# EAGLE design main (EAGLE 9.4.2)

## Sheet 1 of 3: MSP430FR5989 Main Components
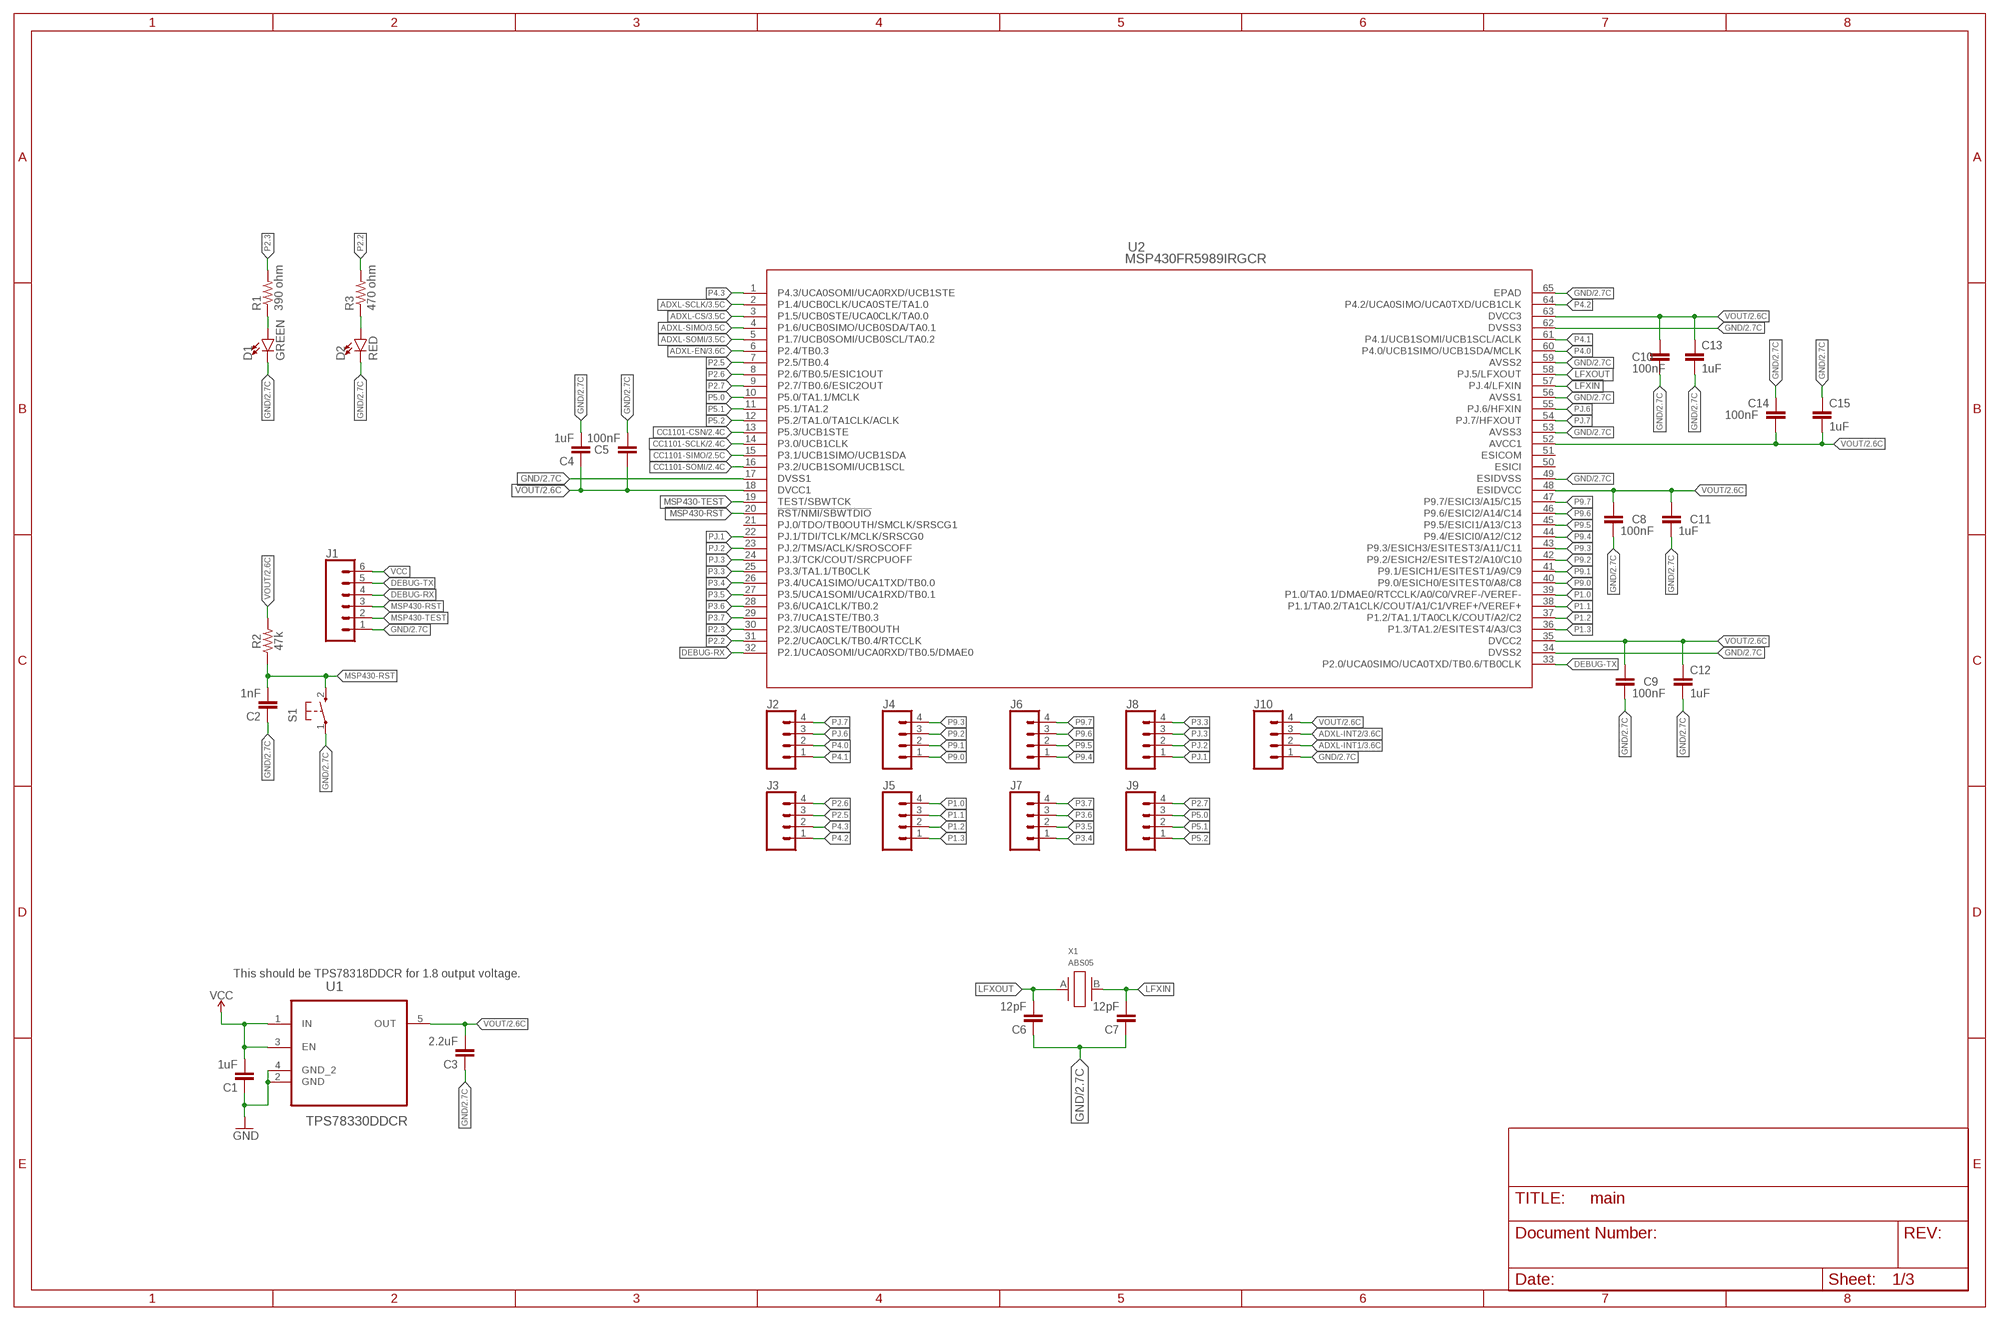
[diagram p0: schematic, sheet 1]

### Parts
C1  1uF  C-EU0603  [0603]
C2  1nF  C-EU0603  [0603]
C3  2.2uF  C-EU0603  [0603]
C4  1uF  C-EU0603  [0603]
C5  100nF  C-EU0603  [0603]
C6  12pF  C-EU0603  [0603]
C7  12pF  C-EU0603  [0603]
C8  100nF  C-EU0603  [0603]
C9  100nF  C-EU0603  [0603]
C10  100nF  C-EU0603  [0603]
C11  1uF  C-EU0603  [0603]
C12  1uF  C-EU0603  [0603]
C13  1uF  C-EU0603  [0603]
C14  100nF  C-EU0603  [0603]
C15  1uF  C-EU0603  [0603]
D1  GREEN  LED-GREEN0603  [LED-0603]
D2  RED  LED-RED0603  [LED-0603]
J1  CONN_06SILK_FEMALE_PTH  [1X06]
J2  CONN_041.27MM  [1X04_1.27MM]
J3  CONN_041.27MM  [1X04_1.27MM]
J4  CONN_041.27MM  [1X04_1.27MM]
J5  CONN_041.27MM  [1X04_1.27MM]
J6  CONN_041.27MM  [1X04_1.27MM]
J7  CONN_041.27MM  [1X04_1.27MM]
J8  CONN_041.27MM  [1X04_1.27MM]
J9  CONN_041.27MM  [1X04_1.27MM]
J10  CONN_041.27MM  [1X04_1.27MM]
R1  390 ohm  R-EU  [0402]
R2  47k  47KOHM-0603-1/10W-1%  [0603]
R3  470 ohm  R-EU  [0402]
S1  ELECTRICALMETER_PB  [ELECTRICALMETER_PBTH]
U1  TPS78330DDCR  [SOT95P280X110-5N]
U2  MSP430FR5989IRGCR  [RGC64_4P25X4P25]
X1  ABS05  ABS05-32.768KHZ-9-T  [ABS05]

### Nets
ADXL-CS: U2.3(P1.5/UCB0STE/UCA0CLK/TA0.0) ; also sheet 3
ADXL-EN: U2.6(P2.4/TB0.3) ; also sheet 3
ADXL-INT1: J10.2 ; also sheet 3
ADXL-INT2: J10.3 ; also sheet 3
ADXL-SCLK: U2.2(P1.4/UCB0CLK/UCA0STE/TA1.0) ; also sheet 3
ADXL-SIMO: U2.4(P1.6/UCB0SIMO/UCB0SDA/TA0.1) ; also sheet 3
ADXL-SOMI: U2.5(P1.7/UCB0SOMI/UCB0SCL/TA0.2) ; also sheet 3
CC1101-CSN: U2.13(P5.3/UCB1STE) ; also sheet 2
CC1101-SCLK: U2.14(P3.0/UCB1CLK) ; also sheet 2
CC1101-SIMO: U2.15(P3.1/UCB1SIMO/UCB1SDA) ; also sheet 2
CC1101-SOMI: U2.16(P3.2/UCB1SOMI/UCB1SCL) ; also sheet 2
DEBUG-RX: J1.4 U2.32(P2.1/UCA0SOMI/UCA0RXD/TB0.5/DMAE0)
DEBUG-TX: J1.5 U2.33(P2.0/UCA0SIMO/UCA0TXD/TB0.6/TB0CLK)
GND: C1.1 C2.1 C3.1 C4.2 C5.2 C6.1 C7.1 C8.2 C9.2 C10.2 C11.2 C12.2 C13.2 C14.1 C15.1 D1.C D2.C J1.1 J10.1 S1.1(P) U1.2(GND) U1.4(GND_2) U2.17(DVSS1) U2.34(DVSS2) U2.49(ESIDVSS) U2.53(AVSS3) U2.56(AVSS1) U2.59(AVSS2) U2.62(DVSS3) U2.65(EPAD) ; also sheet 2,3
LFXIN: C7.2 U2.57(PJ.4/LFXIN) X1.B
LFXOUT: C6.2 U2.58(PJ.5/LFXOUT) X1.A
MSP430-RST: C2.2 J1.3 R2.1 S1.2(S) U2.20(!RST/NMI/SBWTDIO)
MSP430-TEST: J1.2 U2.19(TEST/SBWTCK)
N$19: D1.A R1.1
N$20: D2.A R3.1
P1.0: J5.4 U2.39(P1.0/TA0.1/DMAE0/RTCCLK/A0/C0/VREF-/VEREF-)
P1.1: J5.3 U2.38(P1.1/TA0.2/TA1CLK/COUT/A1/C1/VREF+/VEREF+)
P1.2: J5.2 U2.37(P1.2/TA1.1/TA0CLK/COUT/A2/C2)
P1.3: J5.1 U2.36(P1.3/TA1.2/ESITEST4/A3/C3)
P2.2: R3.2 U2.31(P2.2/UCA0CLK/TB0.4/RTCCLK)
P2.3: R1.2 U2.30(P2.3/UCA0STE/TB0OUTH)
P2.5: J3.3 U2.7(P2.5/TB0.4)
P2.6: J3.4 U2.8(P2.6/TB0.5/ESIC1OUT)
P2.7: J9.4 U2.9(P2.7/TB0.6/ESIC2OUT)
P3.3: J8.4 U2.25(P3.3/TA1.1/TB0CLK)
P3.4: J7.1 U2.26(P3.4/UCA1SIMO/UCA1TXD/TB0.0)
P3.5: J7.2 U2.27(P3.5/UCA1SOMI/UCA1RXD/TB0.1)
P3.6: J7.3 U2.28(P3.6/UCA1CLK/TB0.2)
P3.7: J7.4 U2.29(P3.7/UCA1STE/TB0.3)
P4.0: J2.2 U2.60(P4.0/UCB1SIMO/UCB1SDA/MCLK)
P4.1: J2.1 U2.61(P4.1/UCB1SOMI/UCB1SCL/ACLK)
P4.2: J3.1 U2.64(P4.2/UCA0SIMO/UCA0TXD/UCB1CLK)
P4.3: J3.2 U2.1(P4.3/UCA0SOMI/UCA0RXD/UCB1STE)
P5.0: J9.3 U2.10(P5.0/TA1.1/MCLK)
P5.1: J9.2 U2.11(P5.1/TA1.2)
P5.2: J9.1 U2.12(P5.2/TA1.0/TA1CLK/ACLK)
P9.0: J4.1 U2.40(P9.0/ESICH0/ESITEST0/A8/C8)
P9.1: J4.2 U2.41(P9.1/ESICH1/ESITEST1/A9/C9)
P9.2: J4.3 U2.42(P9.2/ESICH2/ESITEST2/A10/C10)
P9.3: J4.4 U2.43(P9.3/ESICH3/ESITEST3/A11/C11)
P9.4: J6.1 U2.44(P9.4/ESICI0/A12/C12)
P9.5: J6.2 U2.45(P9.5/ESICI1/A13/C13)
P9.6: J6.3 U2.46(P9.6/ESICI2/A14/C14)
P9.7: J6.4 U2.47(P9.7/ESICI3/A15/C15)
PJ.1: J8.1 U2.22(PJ.1/TDI/TCLK/MCLK/SRSCG0)
PJ.2: J8.2 U2.23(PJ.2/TMS/ACLK/SROSCOFF)
PJ.3: J8.3 U2.24(PJ.3/TCK/COUT/SRCPUOFF)
PJ.6: J2.3 U2.55(PJ.6/HFXIN)
PJ.7: J2.4 U2.54(PJ.7/HFXOUT)
VCC: C1.2 J1.6 U1.1(IN) U1.3(EN)
VOUT: C3.2 C4.1 C5.1 C8.1 C9.1 C10.1 C11.1 C12.1 C13.1 C14.2 C15.2 J10.4 R2.2 U1.5(OUT) U2.18(DVCC1) U2.35(DVCC2) U2.48(ESIDVCC) U2.52(AVCC1) U2.63(DVCC3) ; also sheet 2,3
Unconnected: U2.21(PJ.0/TDO/TB0OUTH/SMCLK/SRSCG1) U2.50(ESICI) U2.51(ESICOM)

### Notes on the sheet
- This should be TPS78318DDCR for 1.8 output voltage.

## Sheet 2 of 3: CC1101 components
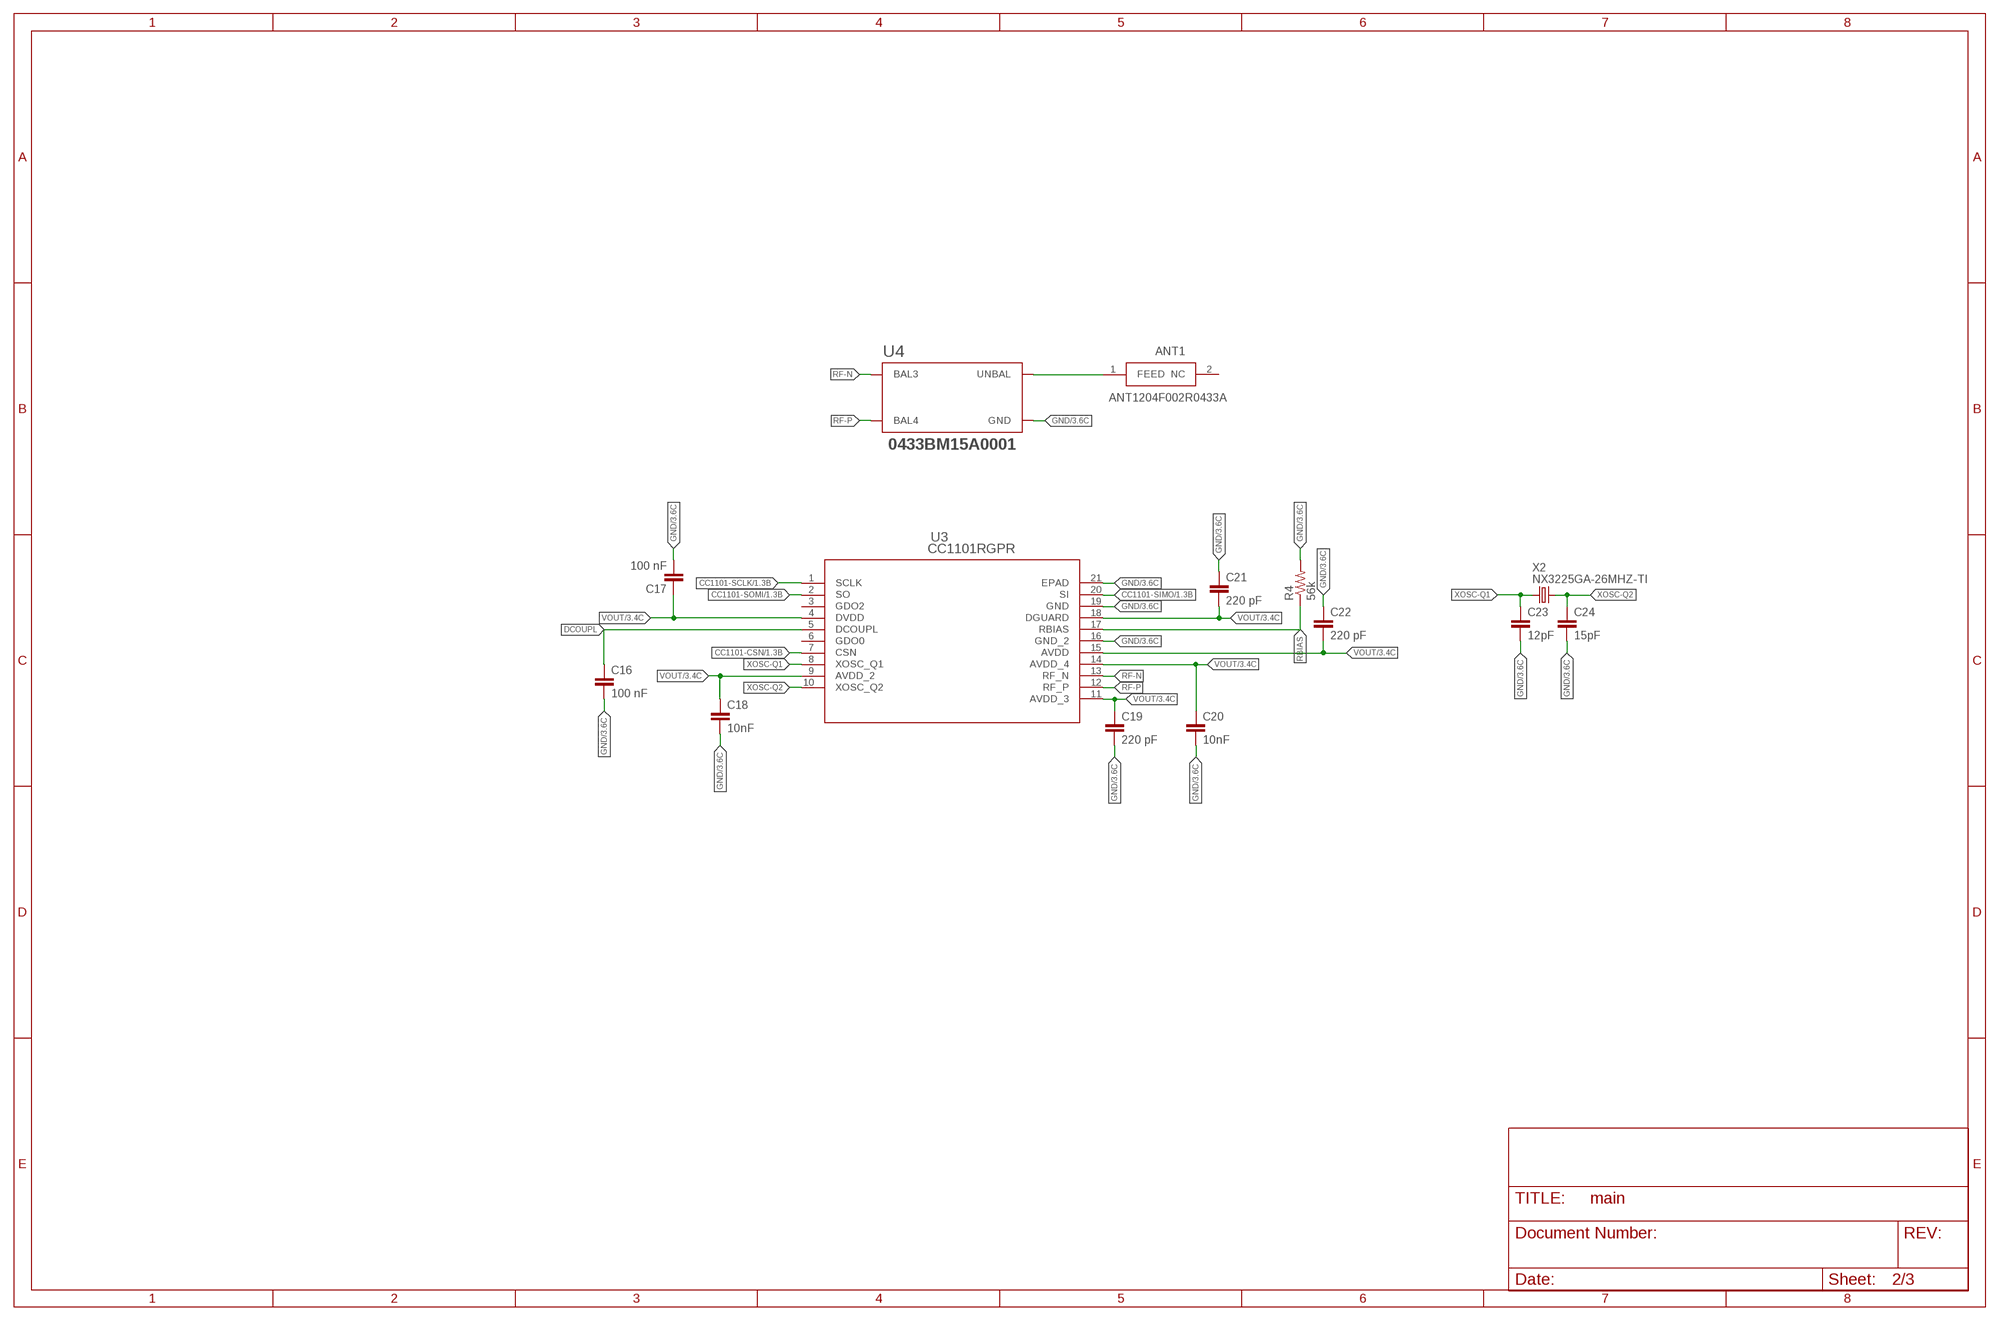
[diagram p1: schematic, sheet 2]

### Parts
ANT1  ANT1204F002R0433A  [ANTC12340X180N]
C16  100 nF  C-EU0603  [0603]
C17  100 nF  C-EU0603  [0603]
C18  10nF  C-EU0603  [0603]
C19  220 pF  C-EU0603  [0603]
C20  10nF  C-EU0603  [0603]
C21  220 pF  C-EU0603  [0603]
C22  220 pF  C-EU0603  [0603]
C23  12pF  C-EU0603  [0603]
C24  15pF  C-EU0603  [0603]
R4  56k  R-EU0603  [0603]
U3  CC1101RGPR  [RGP20_2P4X2P4]
U4  0433BM15A0001  [XXXXBM15A0001]
X2  NX3225GA-26MHZ-TI  XTAL-3.2X2.5  [XTAL-3.2X2.5]

### Nets
CC1101-CSN: U3.7(CSN) ; also sheet 1
CC1101-SCLK: U3.1(SCLK) ; also sheet 1
CC1101-SIMO: U3.20(SI) ; also sheet 1
CC1101-SOMI: U3.2(SO) ; also sheet 1
DCOUPL: C16.1 U3.5(DCOUPL)
GND: C16.2 C17.2 C18.2 C19.2 C20.2 C21.1 C22.1 C23.2 C24.2 R4.2 U3.16(GND_2) U3.19(GND) U3.21(EPAD) U4.2(GND) U4.5(GND) U4.6(GND) ; also sheet 1,3
N$3: ANT1.1(FEED) U4.1(UNBAL)
RBIAS: R4.1 U3.17(RBIAS)
RF-N: U3.13(RF_N) U4.3(BAL3)
RF-P: U3.12(RF_P) U4.4(BAL4)
VOUT: C17.1 C18.1 C19.1 C20.1 C21.2 C22.2 U3.4(DVDD) U3.9(AVDD_2) U3.11(AVDD_3) U3.14(AVDD_4) U3.15(AVDD) U3.18(DGUARD) ; also sheet 1,3
XOSC-Q1: C23.1 U3.8(XOSC_Q1) X2.1
XOSC-Q2: C24.1 U3.10(XOSC_Q2) X2.3
Unconnected: ANT1.2(NC) U3.3(GDO2) U3.6(GDO0)

## Sheet 3 of 3: ADXL362 Acceloremeter
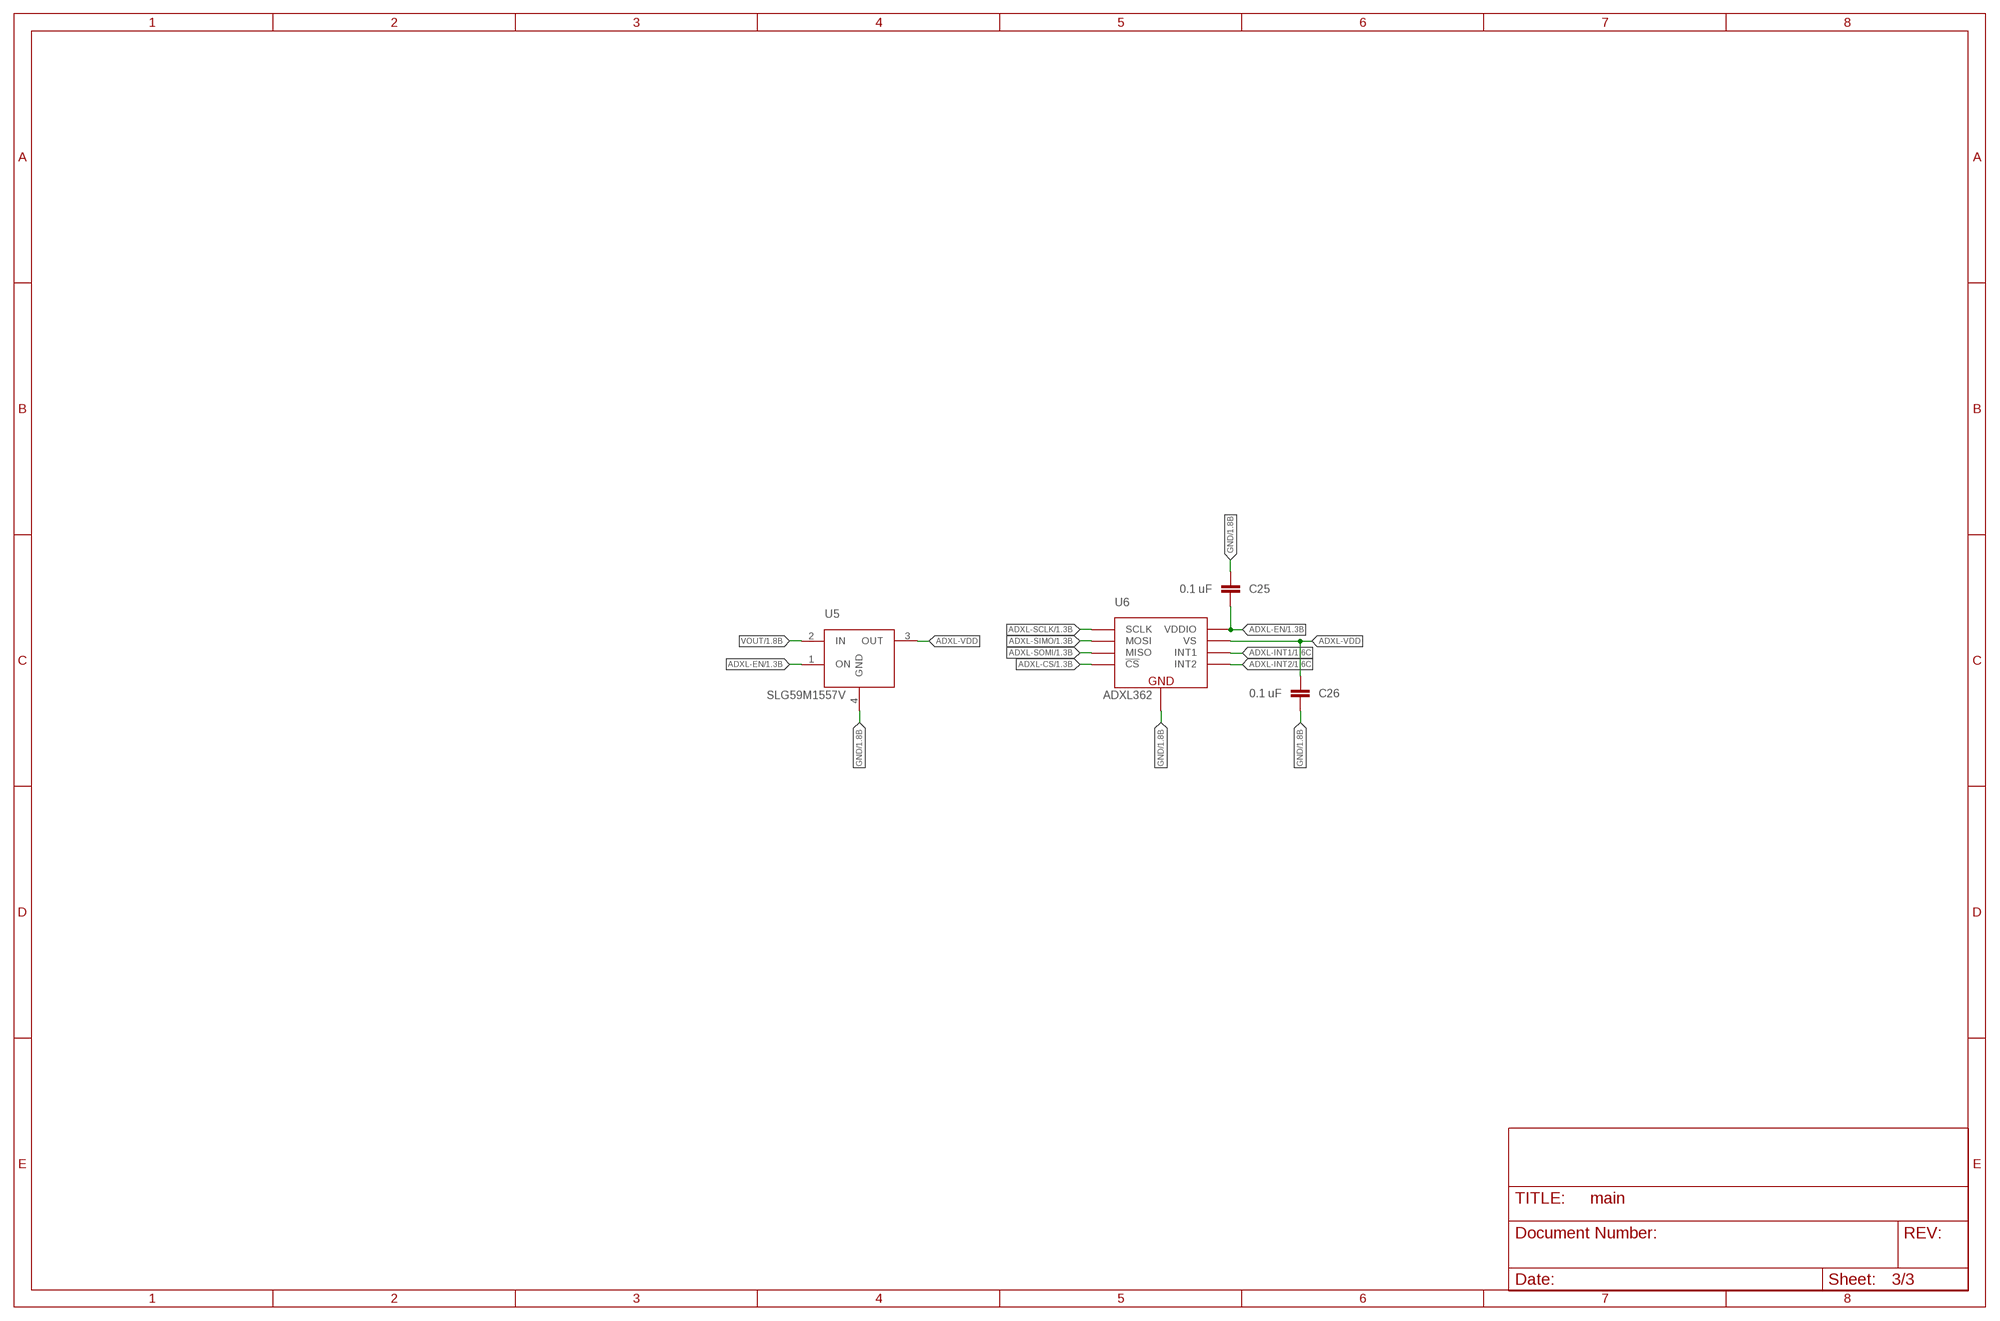
[diagram p2: schematic, sheet 3]

### Parts
C25  0.1 uF  C-EU0603  [0603]
C26  0.1 uF  C-EU0603  [0603]
U5  SLG59M1557V  [4STDFN]
U6  ADXL362  [ADXL362]

### Nets
ADXL-CS: U6.P$8(!CS) ; also sheet 1
ADXL-EN: C25.1 U5.1(ON) U6.P$1(VDDIO) ; also sheet 1
ADXL-INT1: U6.P$11(INT1) ; also sheet 1
ADXL-INT2: U6.P$9(INT2) ; also sheet 1
ADXL-SCLK: U6.P$4(SCLK) ; also sheet 1
ADXL-SIMO: U6.P$6(MOSI) ; also sheet 1
ADXL-SOMI: U6.P$7(MISO) ; also sheet 1
ADXL-VDD: C26.2 U5.3(OUT) U6.P$14(VS)
GND: C25.2 C26.1 U5.4(GND) U6.P$12(GND) U6.P$13(GND) U6.P$16(GND) ; also sheet 1,2
VOUT: U5.2(IN) ; also sheet 1,2

## Library data of the parts
ANT1 = ANT1204F002R0433A:ANT1204F002R0433A: YAGEO - ANT1204F002R0433A - ANTENNA CHIP, 433MHZ, 50 OHM, 1204 Source: Datasheet <http://www.yageo.com/documents/recent/An_SMD_UHF_433_1204_0.pdf>; DESCRIPTION: YAGEO - ANT1204F002R0433A - ANTENNA CHIP, 433MHZ, 50 OHM, 1204; HEIGHT: 1.8mm; MANUFACTURER_NAME: YAGEO (PHYCOMP); MANUFACTURER_PART_NUMBER: ANT1204F002R0433A; MOUSER_PART_NUMBER: 603-ANT1204F002R0433; MOUSER_PRICE-STOCK: https://www.mouser.com/Search/Refine.aspx?Keyword=603-ANT1204F002R0433
C1-C5 C8-C15 C25 C26 = tiny_passives:C-EU
C6 C7 = tiny_passives:C-EU; MPN: CL10C120JB8NNNC
C16-C22 = tiny_passives:C-EU; MPN: GCJ188R71H104KA12D
C23 = tiny_passives:C-EU; MPN: 06035A120FAT2A
C24 = tiny_passives:C-EU; MPN: C1608C0G1H150J080AA
D1 = SparkFun-LED:LED-GREEN: Green SMD LED Used in manufacturing of various products at SparkFun Packages: 0603 - SMD 0603 package [Product Link] <http://www.futureelectronics.com/en/technologies/semiconductors/optoelectronics/leds/Pages/9894312-LTST-C190GKT.aspx?CrossPart=HSMG-C190&IM=0> LilyPad 1206 - SMD1206 LilyPad package [Product Link] <http://www.futureelectronics.com/en/Technologies/Product.aspx?ProductID=IN150NGHARVATEKCORPORATION2049943&IM=0> 1206 - SMD1206 package [Product Link] <http://www.futureelectronics.com/en/technologies/semiconductors/optoelectronics/leds/Pages/8315665-LTST-C150KGKT.aspx?IM=0> 1206 Bottom Mount -SMD 1206 Bottom Mount [Product Link] <http://www.digikey.com/product-detail/en/lite-on-inc/LTST-C230KGKT/160-1456-1-ND/386854> SparkFun Products: Pro Mini 328 -5V <https://www.sparkfun.com/products/821> RedBoard <https://www.sparkfun.com/products/12757> MP3 Trigger <https://www.sparkfun.com/products/13720> Makey Makey <https://www.sparkfun.com/products/11076>; PROD_ID: DIO-00821
D2 = SparkFun-LED:LED-RED: Red SMD LED Used in manufacturing of most products at SparkFun Packages: 0603 - SMD 0603 package [Product Link] <http://docs.avagotech.com/docs/AV02-0551EN> 0603 SMART - SMD 0603 SMART package ( more efficient and expensive)[Product Link] <http://www.osram-os.com/Graphics/XPic2/00077099_0.pdf> 1206 - SMD1206 package [Product Link] <https://www.sparkfun.com/datasheets/DevTools/LilyPad/Q150OVS4.pdff> SparkFun Products: Pro Mini 328 -5V <https://www.sparkfun.com/products/821> RedBoard <https://www.sparkfun.com/products/12757> IOIO-OTG <https://www.sparkfun.com/products/13613>; PROD_ID: DIO-00819
J1 = SparkFun-Connectors:CONN_06: Multi connection point. Often used as Generic Header-pin footprint for 0.1 inch spaced/style header connections On any of the 0.1 inch spaced packages, you can populate with these: Break Away Headers - Straight <https://www.sparkfun.com/products/116> (PRT-00116) Break Away Male Headers - Right Angle <https://www.sparkfun.com/products/553> (PRT-00553) Female Headers <https://www.sparkfun.com/products/115> (PRT-00115) Break Away Headers - Machine Pin <https://www.sparkfun.com/products/117> (PRT-00117) Break Away Female Headers - Swiss Machine Pin <https://www.sparkfun.com/products/743> (PRT-00743) Arduino Stackable Header - 6 Pin <https://www.sparkfun.com/products/9280> (PRT-09280) For SCREWTERMINALS and SPRING TERMINALS visit here: Screw Terimnals on SparkFun.com <https://www.sparkfun.com/search/results?term=Screw+Terminals> (5mm/3.5mm/2.54mm spacing) This device is also useful as a general connection point to wire up your design to another part of your project. Our various solder wires solder well into these plated through hole pads. Hook-Up Wire - Assortment (Stranded, 22 AWG) <https://www.sparkfun.com/products/11375> (PRT-11375) Hook-Up Wire - Assortment (Solid Core, 22 AWG) <https://www.sparkfun.com/products/11367> (PRT-11367) View the entire wire category on our website here <https://www.sparkfun.com/categories/141>; PROD_ID: CONN-08437
J2-J10 = SparkFun-Connectors:CONN_04: Multi connection point. Often used as Generic Header-pin footprint for 0.1 inch spaced/style header connections On any of the 0.1 inch spaced packages, you can populate with these: Break Away Headers - Straight <https://www.sparkfun.com/products/116> (PRT-00116) Break Away Male Headers - Right Angle <https://www.sparkfun.com/products/553> (PRT-00553) Female Headers <https://www.sparkfun.com/products/115> (PRT-00115) Break Away Headers - Machine Pin <https://www.sparkfun.com/products/117> (PRT-00117) Break Away Female Headers - Swiss Machine Pin <https://www.sparkfun.com/products/743> (PRT-00743) For SCREWTERMINALS and SPRING TERMINALS visit here: Screw Terimnals on SparkFun.com <https://www.sparkfun.com/search/results?term=Screw+Terminals> (5mm/3.5mm/2.54mm spacing) This device is also useful as a general connection point to wire up your design to another part of your project. Our various solder wires solder well into these plated through hole pads. Hook-Up Wire - Assortment (Stranded, 22 AWG) <https://www.sparkfun.com/products/11375> (PRT-11375) Hook-Up Wire - Assortment (Solid Core, 22 AWG) <https://www.sparkfun.com/products/11367> (PRT-11367) View the entire wire category on our website here <https://www.sparkfun.com/categories/141> Special notes: Molex polarized connector foot print use with SKU : PRT-08231 with associated crimp pins and housings. 1MM SMD Version SKU: PRT-10208; SPICEPREFIX: E
R1 R3 = tiny_passives:R-EU
R2 = SparkFun-Resistors:47KOHM: 47kΩ resistor A resistor is a passive two-terminal electrical component that implements electrical resistance as a circuit element. Resistors act to reduce current flow, and, at the same time, act to lower voltage levels within circuits. - Wikipedia; PROD_ID: RES-07871
R4 = tiny_passives:R-EU; MPN: ERJ-3GEYJ563V
S1 = tactile-switch:ELECTRICALMETER_PB: OMRON SWITCH
U1 = Texas Instruments_By_element14_Batch_1:TPS78330DDCR: 500nA IQ, 150mA, Ultra-Low Quiescent Current Low-Dropout Linear Regulator; MPN: TPS78330DDCR; OC_FARNELL: -; OC_NEWARK: 72R6681; PACKAGE: SOT-5; SUPPLIER: Texas Instruments
U2 = msp430fr5989irgcr:MSP430FR5989IRGCR; MANUFACTURER_PART_NUMBER: MSP430FR5989IRGCR; VENDOR: Texas Instruments
U3 = cc1101RGPR:CC1101RGPR; MANUFACTURER_PART_NUMBER: CC1101RGPR; VENDOR: Vendor
U4 = johanson-baluns:0433BM15A0001: 430/403 MHz Impedance Matched Balun/LPF Integrated Component for T.I. Chipsets: CC1100, CC1101, CC110L, CC1111, CC1130, CC1131, CC1150, CC1151, CC113L, CC115L, CC430 and RF430.
U5 = loadswitches:SLG59M1557V: SILEGO SLG59M1557V: Ultra-small 28.5 mΩ, 1.0 A Integrated Power Switch with Discharge The SLG59M1557V is designed for load switching applications with ultra low quiescent current (20nA), and low turn on voltage (0.85V). The part comes with one 28.5 mΩ 1.0 A rated P-channel MOSFET controlled by a single ON control pin. The product is packaged in an ultra-small 1.0 x 1.0 mm package.; MANAFACTURER: SLG59M1557V; MOUSER: 402-SLG59M1557V; MPN: SLG59M1557V
U6 = adxl362:ADXL362: Micropower 3-axis accelerometer 2/4/8g digital output (SPI); DIGIKEY: ADXL362BCCZ-RL7CT-ND; MPN: ADXL362BCCZ-RL7
X1 = abs05:ABS05-32.768KHZ: 32.768kHz Crystal; DIGIKEY: 535-11897-1-ND; MPN: ABS05-32.768KHZ-9-T
X2 = cc1101:XTAL

## Net classes
1 Ground: width 0.203 mm, drill 0.305 mm, clearance 0.152 mm to class 0, clearance 0.152 mm

## Board
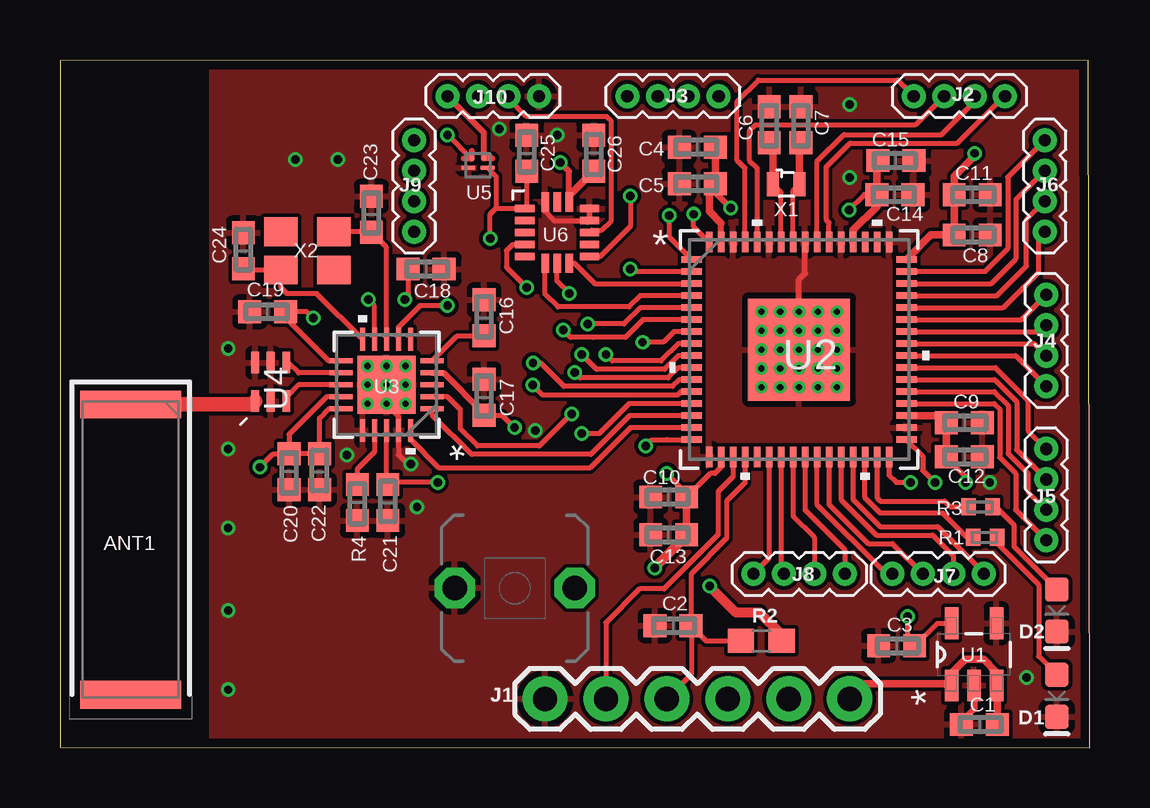
[diagram p3: board, top side]
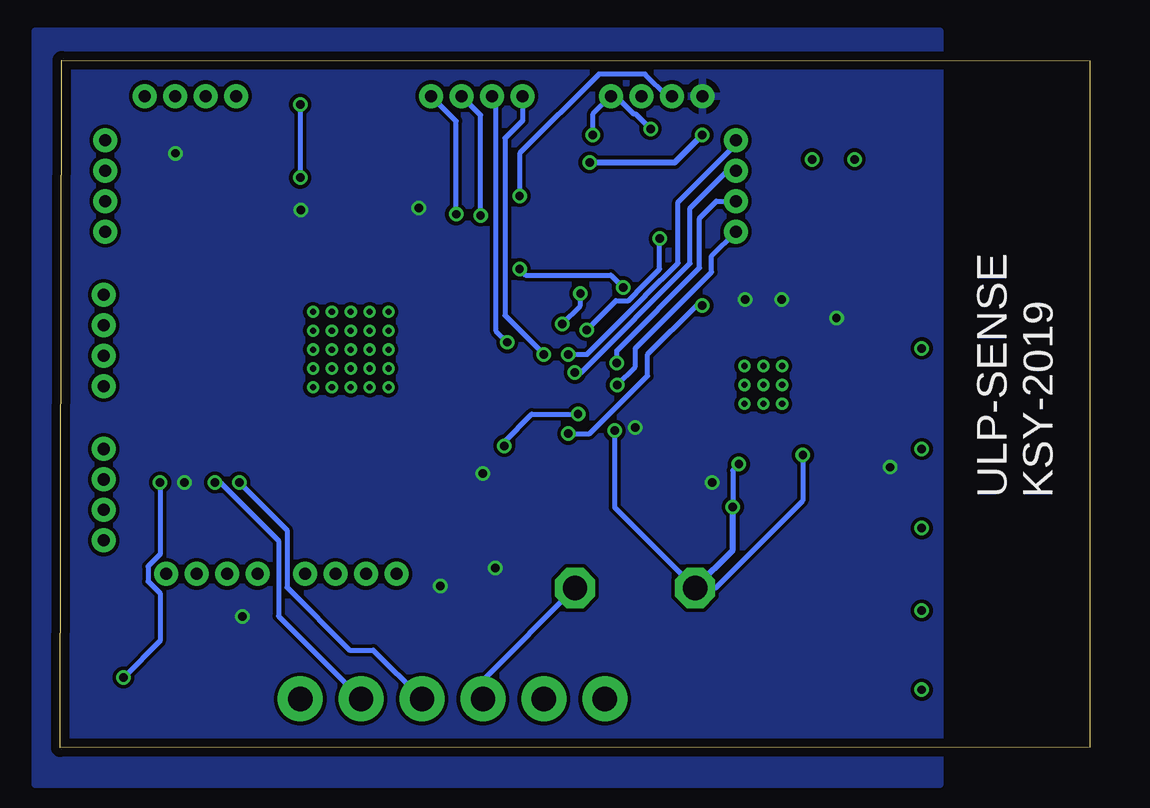
[diagram p4: board, bottom side, seen from below]

Size 42.93 x 28.65 mm. Coordinates in mm from the lower left corner, seen from the top.
Outline: 0,0.03 42.93,0 42.86,28.65 0,28.63 0,0.03
Copper layers (1*16): Top 0.035559375mm / dielectric 1.6mm / Bottom 0.035559375mm
Design rules "oshpark-2layer *": minimum track width 6mil, minimum drill 10mil, track to track 6mil, track to pad 6mil, pad to pad 6mil, via to via 6mil, smd to smd 6mil, copper to edge 15mil, drill to drill 6mil, minimum pad ring 5mil, minimum via ring 5mil, stop-mask expansion 2.5mil, vias tented up to drill 0mil, thermal gap 10mil

### Footprints (pad centres in the part's own frame; a part is rotated, then mirrored left to right if it is on the bottom)
ANTC12340X180N = smd 1.15 x 4.2: 1 -6.05,0; 2 6.05,0
0603 = smd 0.95 x 0.95: 1 -0.75,0; 2 0.75,0
LED-0603 = smd 1 x 1: A -0.877,0; C 0.877,0
1X06 = drill 1.016 pad 1.88: 1 0,0; 2 2.54,0; 3 5.08,0; 4 7.62,0; 5 10.16,0; 6 12.7,0
1X04_1.27MM = drill 0.508 pad 1: 1 0,0; 2 1.27,0; 3 2.54,0; 4 3.81,0
0402 = smd 0.6 x 0.7: 1 -0.5,0; 2 0.5,0
0603' = smd 1.1 x 1: 1 -0.85,0; 2 0.85,0
ELECTRICALMETER_PBTH = drill 1.016 pad 1.676 octagon: 1 -0.001,0.001; 2 5.001,0.001
SOT95P280X110-5N = smd 1.321 x 0.559: 1 -1.295,0.94; 2 -1.295,0; 3 -1.295,-0.94; 4 1.295,-0.94; 5 1.295,0.94
RGC64_4P25X4P25 = smd 0.85 x 0.28: 1 -4.475,3.75; 2 -4.475,3.25; 3 -4.475,2.75; 4 -4.475,2.25; 5 -4.475,1.75; 6 -4.475,1.25; 7 -4.475,0.75; 8 -4.475,0.25; 9 -4.475,-0.25; 10 -4.475,-0.75; 11 -4.475,-1.25; 12 -4.475,-1.75; 13 -4.475,-2.25; 14 -4.475,-2.75; 15 -4.475,-3.25; 16 -4.475,-3.75; 33 4.475,-3.75; 34 4.475,-3.25; 35 4.475,-2.75; 36 4.475,-2.25; 37 4.475,-1.75; 38 4.475,-1.25; 39 4.475,-0.75; 40 4.475,-0.25; 41 4.475,0.25; 42 4.475,0.75; 43 4.475,1.25; 44 4.475,1.75; 45 4.475,2.25; 46 4.475,2.75; 47 4.475,3.25; 48 4.475,3.75 | smd 0.28 x 0.85: 17 -3.751,-4.475; 18 -3.251,-4.475; 19 -2.751,-4.475; 20 -2.251,-4.475; 21 -1.75,-4.475; 22 -1.25,-4.475; 23 -0.75,-4.475; 24 -0.25,-4.475; 25 0.25,-4.475; 26 0.75,-4.475; 27 1.25,-4.475; 28 1.75,-4.475; 29 2.251,-4.475; 30 2.751,-4.475; 31 3.251,-4.475; 32 3.751,-4.475; 49 3.751,4.475; 50 3.251,4.475; 51 2.751,4.475; 52 2.251,4.475; 53 1.75,4.475; 54 1.25,4.475; 55 0.75,4.475; 56 0.25,4.475; 57 -0.25,4.475; 58 -0.75,4.475; 59 -1.25,4.475; 60 -1.75,4.475; 61 -2.251,4.475; 62 -2.751,4.475; 63 -3.251,4.475; 64 -3.751,4.475 | smd 4.25 x 4.25: 65 0,0 | drill 0.254 pad 0.508: V -1.575,-1.575; V_1 -1.575,-0.787; V_2 -1.575,0; V_3 -1.575,0.787; V_4 -1.575,1.575; V_5 -0.787,-1.575; V_6 -0.787,-0.787; V_7 -0.787,0; V_8 -0.787,0.787; V_9 -0.787,1.575; V_10 0,-1.575; V_11 0,-0.787; V_12 0,0; V_13 0,0.787; V_14 0,1.575; V_15 0.787,-1.575; V_16 0.787,-0.787; V_17 0.787,0; V_18 0.787,0.787; V_19 0.787,1.575; V_20 1.575,-1.575; V_21 1.575,-0.787; V_22 1.575,0; V_23 1.575,0.787; V_24 1.575,1.575
RGP20_2P4X2P4 = smd 0.953 x 0.203: 1 -1.899,1; 2 -1.899,0.5; 3 -1.899,0; 4 -1.899,-0.5; 5 -1.899,-1; 11 1.899,-1; 12 1.899,-0.5; 13 1.899,0; 14 1.899,0.5; 15 1.899,1 | smd 0.203 x 0.953: 6 -1,-1.899; 7 -0.5,-1.899; 8 0,-1.899; 9 0.5,-1.899; 10 1,-1.899; 16 1,1.899; 17 0.5,1.899; 18 0,1.899; 19 -0.5,1.899; 20 -1,1.899 | smd 2.413 x 2.413: 21 0,0 | drill 0.254 pad 0.508: P$1 -0.787,0.787; P$2 0,0.787; P$3 0.787,0.787; P$4 0.787,0; P$5 0,0; P$6 -0.787,0; P$7 -0.787,-0.787; P$8 0,-0.787; P$9 0.787,-0.787
XXXXBM15A0001 = smd 0.33 x 0.9: 1 0.65,0.8; 2 0,0.8; 3 -0.65,0.8; 4 -0.65,-0.8; 5 0,-0.8; 6 0.65,-0.8
4STDFN = smd 0.6 x 0.2: 1 -0.4,0.1; 4 0.4,0.1 | smd 0.152 x 0.152: 2 -0.25,-0.3; 3 0.25,-0.3
ADXL362 = smd 0.8 x 0.3: P$1 -1.35,1; P$2 -1.35,0.5; P$3 -1.35,0; P$4 -1.35,-0.5; P$5 -1.35,-1; P$9 1.35,-1; P$10 1.35,-0.5; P$11 1.35,0; P$12 1.35,0.5; P$13 1.35,1 | smd 0.3 x 0.8: P$6 -0.5,-1.275; P$7 0,-1.275; P$8 0.5,-1.275; P$14 0.5,1.275; P$15 0,1.275; P$16 -0.5,1.275
ABS05 = smd 0.5 x 1: A -0.55,0; B 0.55,0
XTAL-3.2X2.5 = smd 1.4 x 1.2: 1 -1.1,-0.8; 2 1.1,-0.8; 3 1.1,0.8; 4 -1.1,0.8

### Placement (x,y rotation side)
ANT1  2.95,8.26 270 top
C1  38.33,0.97 0 top
C2  25.55,5.08 0 top
C3  34.87,4.24 0 top
C4  26.57,25.02 180 top
C5  26.57,23.5 180 top
C6  29.57,25.96 270 top
C7  30.89,25.96 270 top
C8  38.02,21.36 0 top
C9  37.69,13.54 0 top
C10  25.37,10.44 180 top
C11  38.02,23.04 0 top
C12  37.69,12.12 0 top
C13  25.37,8.86 180 top
C14  34.8,23.04 180 top
C15  34.85,24.46 180 top
C16  17.68,17.91 90 top
C17  17.68,14.61 90 top
C18  15.27,19.94 0 top
C19  8.66,18.16 180 top
C20  9.55,11.49 270 top
C21  13.67,10.21 90 top
C22  10.82,11.49 90 top
C23  12.98,22.23 90 top
C24  7.65,20.7 90 top
C25  19.46,24.77 90 top
C26  22.25,24.77 270 top
D1  41.55,2.16 270 top
D2  41.55,5.72 270 top
J1  20.22,2.03 0 top
J2  35.59,27.15 0 top
J3  27.46,27.15 180 top
J4  41.11,15.06 90 top
J5  41.11,8.64 90 top
J6  41.05,21.5 90 top
J7  34.7,7.24 0 top
J8  28.91,7.24 0 top
J9  14.76,21.5 90 top
J10  19.96,27.15 180 top
R1  38.56,8.76 180 top
R2  47k  [0603']  29.24,4.45 0 top
R3  38.38,10.03 180 top
R4  12.4,10.21 270 top
S1  16.46,6.65 0 top
U1  38.1,3.89 90 top
U2  30.81,16.59 0 top
U3  13.61,15.11 180 top
U4  8.79,15.24 180 top
U5  17.42,24.26 180 top
U6  20.73,21.46 0 top
X1  30.28,23.47 0 top
X2  10.31,20.7 180 top

### Tracks (layer width: path | path; a pad name or v marks a point on that pad's centre or on a via)
ADXL-CS
  Top 0.203: U6.P$8 21.44,20.19 22.29,19.34 U2.3
ADXL-EN  (via drill 0.35)
  Top 0.203: U2.6 24.3,17.84 23.57,17.1 22.23,17.1 21.28,17.1 v20.98,17.4 | C25.1 19.46,22.54 U6.P$1 18.2,22.46 18.19,22.48 | U5.1 18.19,23.8 18.19,22.48 | v17.93,21.21 17.93,22.23 18.19,22.48
  Bottom 0.203: v20.98,17.4 19.76,18.62 19.23,18.62 18.9,18.95 18.9,18.97 17.93,19.93 v17.93,21.21
ADXL-INT1
  Top 0.203: U6.P$11 22.17,21.56 22.58,21.56 22.98,21.96 22.98,26.09 22.79,26.29 19.46,26.29 18.69,27.05 J10.2
ADXL-INT2  (via drill 0.35)
  Top 0.203: v23.77,22.99 23.77,21.72 22.52,20.46 U6.P$9
  Bottom 0.203: J10.3 17.61,27.15 18.54,28.07 20.47,28.07 23.77,24.77 v23.77,22.99
ADXL-SCLK  (via drill 0.35)
  Top 0.203: U2.2 23.88,19.84 v23.77,19.94 | U6.P$4 18.87,20.96 18.61,20.71 18.61,20.02 v19.46,19.18
  Bottom 0.203: v23.77,19.94 23.52,19.69 19.96,19.69 v19.46,19.18
ADXL-SIMO
  Top 0.203: U2.4 24.2,18.84 23.73,18.37 20.75,18.37 20.23,18.89 U6.P$6
ADXL-SOMI  (via drill 0.35)
  Top 0.203: U2.5 24.2,18.34 23.52,17.65 v22,17.65 | v21.23,18.92 20.73,19.43 U6.P$7
  Bottom 0.203: v22,17.65 21.23,18.42 v21.23,18.92
ADXL-VDD  (via drill 0.35)
  Top 0.203: v16.15,25.53 v16.16,25.53 17.15,24.54
  Top 0.254: U5.3 17.15,24.54 | U6.P$14 21.23,24.01 v20.85,24.38
  Top 0.305: C26.2 21.23,22.99 U6.P$14
  Bottom 0.254: v20.85,24.38 17.3,24.38 v16.15,25.53
CC1101-CSN  (via drill 0.35)
  Top 0.203: U2.13 23.73,14.34 22.47,13.08 v21.74,13.08 | v16.15,18.42 15.01,18.42 14.11,17.52 U3.7
  Bottom 0.203: v21.74,13.08 20.85,13.08 18.44,15.49 18.44,16.38 16.41,18.42 v16.15,18.42
CC1101-SCLK
  Top 0.203: U3.1 15.51,13.86 17.16,12.22 22.13,12.22 23.75,13.84 U2.14
CC1101-SIMO
  Top 0.203: U2.15 23.78,13.34 22.09,11.65 15.81,11.65 14.61,12.84 U3.20
CC1101-SOMI  (via drill 0.35)
  Top 0.203: v24.41,12.57 24.66,12.83 25.31,12.83 25.32,12.84 U2.16 | U3.2 16.16,14.61 16.7,14.08 16.7,13.28 17.4,12.57 19.99,12.57 21.31,13.89 v21.34,13.89
  Bottom 0.203: v24.41,12.57 24.41,12.75 23.27,13.89 v21.34,13.89
DCOUPL
  Top 0.203: U3.5 16.56,17.16 C16.1
DEBUG-RX  (via drill 0.35)
  Top 0.203: U2.32 34.56,11.35 34.86,11.05 v35.46,11.05
  Bottom 0.203: J1.4 29.87,4.06 30.86,4.06 33.47,6.67 33.47,9.06 v35.46,11.05
DEBUG-TX  (via drill 0.35)
  Top 0.203: U2.33 35.97,12.16 35.97,11.56 v36.47,11.05
  Bottom 0.203: v36.47,11.05 36.24,11.05 33.82,8.63 33.82,5.48 J1.5
GND  (via drill 0.35)
  Top 0.203: U6.P$16 20.2,22.71 20.2,22.36 20.59,21.96 U6.P$12 U6.P$13 | v14.63,11.81 14.5,11.81 14.11,12.2 U3.19 14.11,13.8 13.61,14.31 U3.21
  Top 0.254: U2.65 30.81,19.51 31.06,19.76 U2.56 | C1.1 37.58,1.1 38.13,1.65 38.13,2.57 U1.2
  Bottom 0.203: v20.73,25.53 20.73,26.38 J10.1 19.76,27.15 19.01,26.39 18.92,26.39 v18.31,25.78 | v32.92,26.8 v32.92,23.75 | v40.28,2.92 38.76,4.45 38.76,6.43 39.26,6.93 39.26,7.55 38.76,8.05 v38.76,11.05 | v14.63,11.81 14.88,11.56 v14.88,10.03 | v19.81,13.21 19.81,10.01 S1.1 15.6,6.66 11.96,10.29 v11.96,12.19
  Bottom 0.254: S1.1 14.88,8.23 v14.88,10.03
  other vias: 7.01,16.64 7.01,12.45 7.01,9.14 11.58,24.51 9.8,24.51 7.01,5.72 7.01,2.41
  pour Top: 6.31,29.77 6.31,-1.45 43.64,-1.45 43.64,29.77
LFXIN
  Top 0.203: U2.57 30.56,23.2 X1.B
  Top 0.305: X1.B 30.83,25.15 C7.2
LFXOUT
  Top 0.203: U2.58 30.06,23.14 X1.A
  Top 0.305: X1.A 29.73,25.05 C6.2
MSP430-RST
  Top 0.203: U2.20 28.56,11.03 27.79,10.26 27.79,8.72 26.3,7.23 C2.2 | C2.2 26.94,4.45 R2.1 | C2.2 26.31,5.07 26.31,3.05 J1.3
  Bottom 0.203: S1.2 25.3,2.82 J1.3
MSP430-TEST
  Top 0.203: J1.2 22.76,5.21 24.16,6.61 25.18,6.61 27.43,8.87 27.43,10.67 28.06,11.29 U2.19
N$3
  Top 0.61: ANT1.1 8,14.31 U4.1
N$19
  Top 0.203: R1.1 39.06,8.51 40.79,6.78 40.79,3.8 D1.A
N$20
  Top 0.203: D2.A 39.78,8.37 39.78,9.27 39.01,10.03 R3.1
P1.0
  Top 0.203: U2.39 38.99,15.84 40.35,14.48 40.35,13.21 J5.4
P1.1
  Top 0.203: U2.38 38.96,15.34 39.88,14.41 39.88,12.4 J5.3
P1.2
  Top 0.203: J5.2 40.35,10.67 40.35,11.43 39.53,12.25 39.53,14.27 38.96,14.84 U2.37
P1.3
  Top 0.203: J5.1 39.84,9.91 39.84,11.43 39.17,12.1 39.17,14.12 38.95,14.34 U2.36
P2.2
  Top 0.203: U2.31 34.06,10.41 34.2,10.28 36.88,10.28 37.12,10.03 R3.2
P2.3
  Top 0.203: U2.30 33.56,10.41 34.2,9.77 36.8,9.77 37.81,8.76 R1.2
P2.5  (via drill 0.35)
  Top 0.203: v24.28,16.89 25.15,16.89 25.6,17.34 U2.7
  Bottom 0.203: J3.3 24.77,26.99 24.77,17.37 v24.28,16.89
P2.6  (via drill 0.35)
  Top 0.203: U2.8 25.78,16.84 25.05,16.11 23.03,16.11 v22.76,16.38
  Bottom 0.203: J3.4 23.65,26.13 24.38,25.39 24.38,18.01 v22.76,16.38
P2.7  (via drill 0.35)
  Top 0.203: U2.9 25.78,16.34 25.2,15.76 22.37,15.76 v21.74,16.38
  Bottom 0.203: v21.74,16.38 20.96,16.38 18.54,18.8 18.54,18.82 17.17,20.19 17.17,22.73 14.76,25.15 J9.4
P3.3
  Top 0.203: U2.25 31.06,9.91 32.72,8.26 J8.4
P3.4
  Top 0.203: U2.26 31.56,10.12 34.44,7.24 J7.1
P3.5
  Top 0.203: U2.27 32.06,10.14 33.7,8.5 34.7,8.5 J7.2
P3.6
  Top 0.203: U2.28 32.56,10.33 34.04,8.86 36.38,8.86 37.24,8 J7.3
P3.7
  Top 0.203: U2.29 33.06,10.34 34.19,9.21 36.58,9.21 38.51,7.29 J7.4
P4.0
  Top 0.203: U2.60 29.06,24.15 28.73,24.48 28.73,25.68 28.99,25.94 35.65,25.94 J2.2
P4.1
  Top 0.203: U2.61 28.56,24.15 28.23,24.48 28.23,26.93 29.11,27.81 34.92,27.81 J2.1
P4.2  (via drill 0.35)
  Top 0.203: U2.64 26.42,21.71 v26.42,22.23
  Bottom 0.203: v26.42,22.23 26.42,26.11 J3.1
P4.3  (via drill 0.35)
  Top 0.203: U2.1 25.4,21.27 v25.4,22.17
  Bottom 0.203: v25.4,22.17 25.4,26.36 J3.2
P5.0  (via drill 0.35)
  Top 0.203: U2.10 25.78,15.84 25.35,15.4 21.69,15.4 v21.47,15.62
  Bottom 0.203: v21.47,15.62 21.21,15.62 16.66,20.17 16.66,22.48 15.1,24.04 J9.3
P5.1  (via drill 0.35)
  Top 0.203: v19.72,16.03 20.03,16.03 21.01,15.05 25.54,15.05 25.83,15.34 U2.11
  Bottom 0.203: v19.72,16.03 19.72,16.54 16.27,19.98 16.27,22.07 15.57,22.77 J9.2
P5.2  (via drill 0.35)
  Top 0.203: U2.12 25.89,14.84 25.74,14.69 20.13,14.69 v19.71,15.11
  Bottom 0.203: v19.71,15.11 18.95,15.88 18.95,16.64 15.77,19.81 15.77,20.48 J9.1
P9.0
  Top 0.203: U2.40 39.84,16.34 J4.1
P9.1
  Top 0.203: U2.41 40.61,16.84 J4.2
P9.2
  Top 0.203: U2.42 40.84,17.34 J4.3
P9.3
  Top 0.203: U2.43 40.07,17.84 J4.4
P9.4
  Top 0.203: U2.44 39.32,18.34 40.79,19.81 40.79,21.25 J6.1
P9.5
  Top 0.203: U2.45 39.05,18.84 40.28,20.07 40.28,22.01 J6.2
P9.6
  Top 0.203: U2.46 38.81,19.34 39.86,20.38 39.86,22.85 J6.3
P9.7
  Top 0.203: J6.4 39.5,23.77 39.5,20.78 38.58,19.86 38.56,19.84 U2.47
PJ.1
  Top 0.203: U2.22 29.56,7.89 J8.1
PJ.2
  Top 0.203: U2.23 30.06,7.35 J8.2
PJ.3
  Top 0.203: U2.24 30.56,9.65 31.45,8.76 J8.3
PJ.6
  Top 0.203: U2.55 31.56,24.42 32.68,25.55 36.75,25.55 38.13,26.92 J2.3
PJ.7
  Top 0.203: U2.54 32.06,21.87 31.93,22 31.93,24.19 32.93,25.19 37.41,25.19 39.36,27.15 J2.4
RBIAS
  Top 0.203: U3.17 13.11,12.33 12.4,11.61 R4.1
RF-N
  Top 0.203: U3.13 9.93,15.11 9.44,14.62 U4.3
RF-P
  Top 0.203: U3.12 9.94,15.61 9.51,16.04 U4.4
VCC
  Top 0.305: C1.2 39.08,2.55 U1.3 39.04,3.15 38.51,3.68 37.74,3.68 37.16,3.1 U1.1 37.08,2.67 33.55,2.67 J1.6
VOUT  (via drill 0.35)
  Top 0.203: v37.74,11.05 37.74,11.32 C12.1 | v35.33,5.46 35.33,4.54 C3.2 36.56,5.18 U1.5 | v32.89,22.4 33.53,23.04 C14.2 | U2.18 27.56,11.69 27.3,11.43 27.12,11.43 C10.1 26.12,10.6 v25.3,11.43 | U3.18 13.61,11.01 C21.2 13.75,11.05 v15.75,11.05 | U3.15 11.21,14.11 10.82,13.73 C22.2 C20.1 | U3.14 11.11,14.61 9.55,13.06 C20.1 | U3.11 11.21,16.11 9.41,17.91 C19.1 10.31,18.16 v10.57,17.91 | U3.9 13.11,18.41 v12.85,18.67 | C17.1 18.43,13.86 v18.95,13.34 | C18.1 14.52,18.81 v14.38,18.67 | v8.33,11.68 8.89,12.24 C20.1
  Top 0.254: U5.2 17.67,25.63 J10.4 | U2.63 27.56,21.86 | v27.97,22.48 27.32,23.13 C5.1 | C17.1 17.68,13.92 15.99,15.61 U3.4
  Top 0.305: C10.1 C13.1 | C15.2 34.05,24.41 C14.2 34.05,22.54 33.06,21.56 U2.52 | U2.48 36.31,21.36 C8.1 C11.1 37.27,23.8 38.18,24.71 v38.13,24.77 | C12.1 C9.1 36.65,13.84 U2.35 | 27.56,21.86 27.06,22.35 27.06,23.24 C5.1 C4.1
  Top 0.406: v27.08,6.73 28.19,5.62 29.16,5.62 30.09,4.7 R2.2 | v24.79,7.49 26.12,8.83 C13.1
  pour Bottom: 43.97,29.84 43.97,-1.52 6.25,-1.52 6.25,29.84
XOSC-Q1
  Top 0.203: U3.8 13.61,20.84 C23.1 12.95,21.5 X2.1
XOSC-Q2
  Top 0.203: U3.10 10.71,18.92 9.46,18.92 9.21,19.17 X2.3 7.7,19.9 C24.1

### Text on the board
bNames: ULP-SENSE / KSY-2019